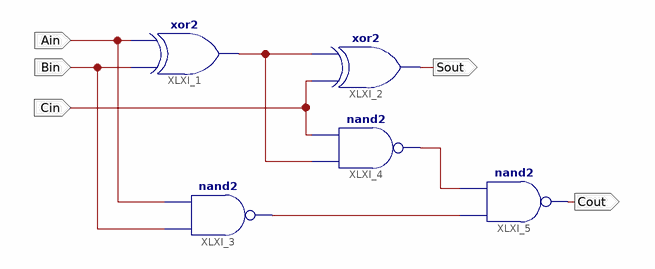
[diagram p0: schematic sheet 1]
// Xilinx ISE schematic fa.sch (spartan3e) as structural Verilog: 5 symbols, 5 ports
module fa (
  input  Ain,
  input  Bin,
  input  Cin,
  output Cout,
  output Sout
);

  wire XLXN_2, XLXN_3, XLXN_5;

  xor XLXI_1 (XLXN_5, Bin, Ain);
  xor XLXI_2 (Sout, Cin, XLXN_5);
  nand XLXI_3 (XLXN_3, Bin, Ain);
  nand XLXI_4 (XLXN_2, XLXN_5, Cin);
  nand XLXI_5 (Cout, XLXN_3, XLXN_2);
endmodule
